# Altium schematic sheet 12_LPDDR4.schdoc
size 431 x 309 mm; Symbol: Sheet-Symbol_A4; Device: Sheet-Symbol_A4; Company: 嘉立创EDA; Version: V1.0; Page Size: A4; @Project Name: RK3568核心板; @Page Count: 11; @Update Date: 2024-10-10; @Create Date: 2024-10-10; @Schematic Name: Schematic1; @Page No: 11; @Page Name: LPDDR4; @Board Name: Board1; @Create Time: 11:38:53; @Update Time: 14:28:43; Width: 1655; Height: 1170; Region Start: 1; X Region Count: 6; Y Region Count: 4; Blade Width: 10; Title Block Position: 3
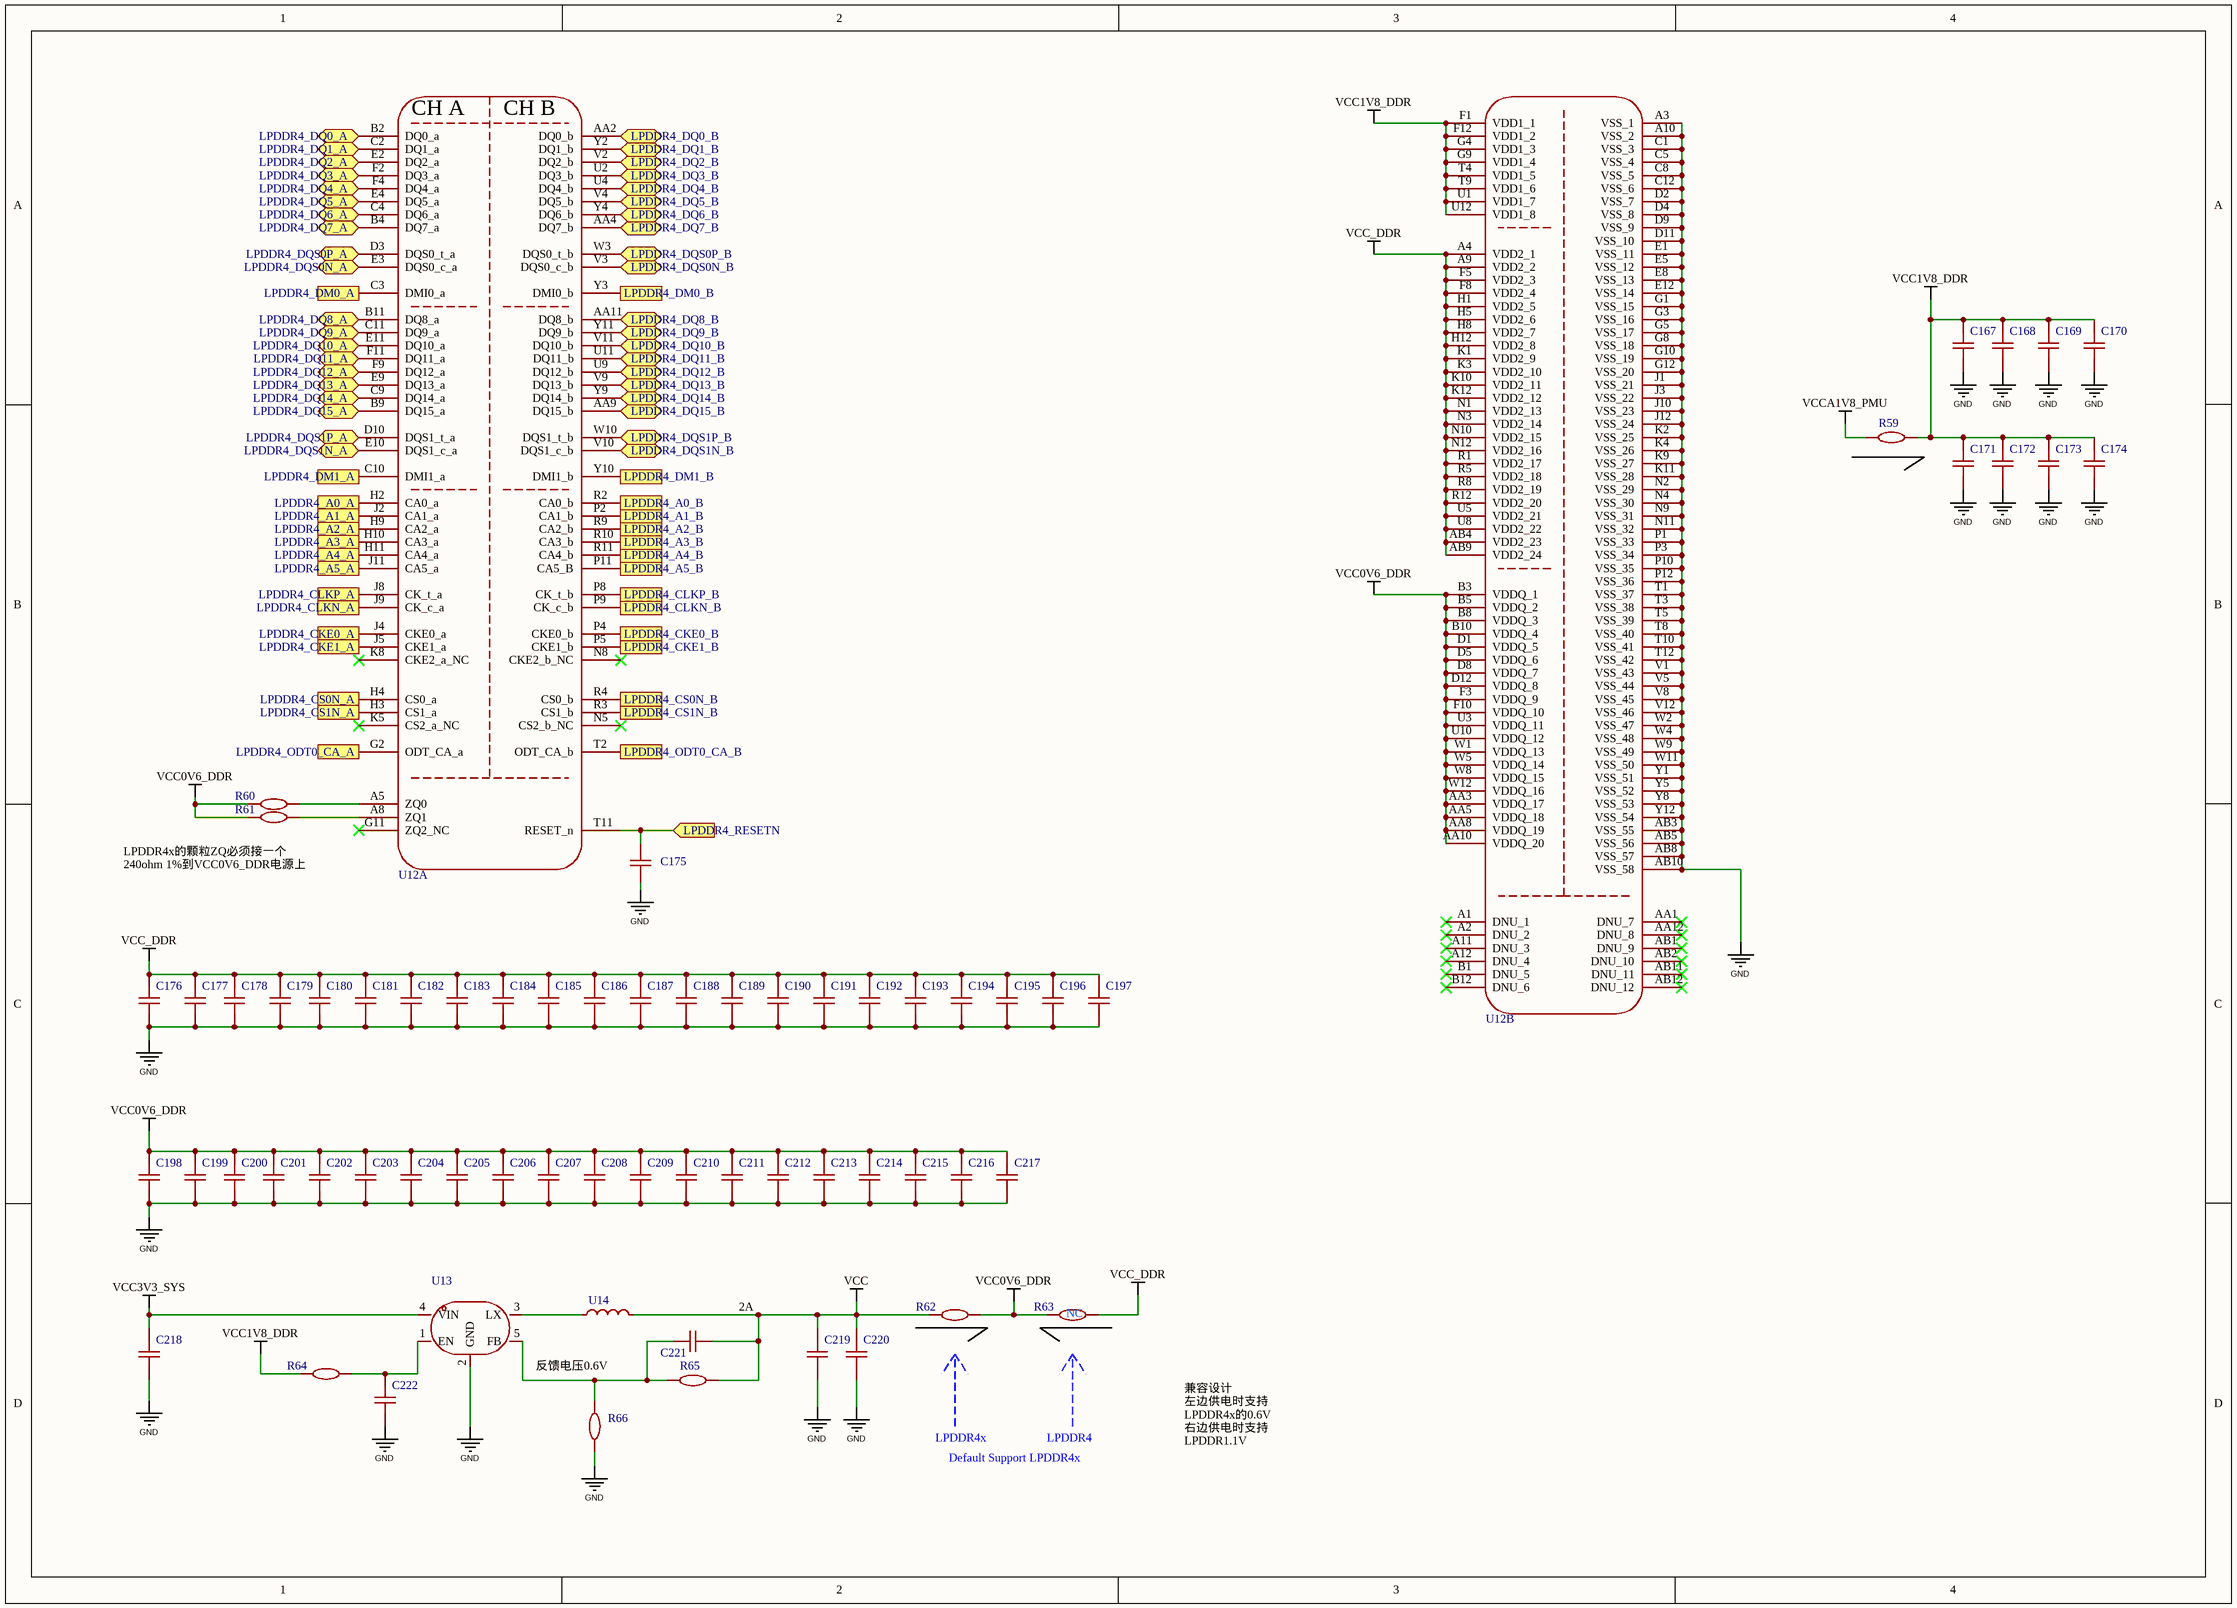
[diagram p0: 12_LPDDR4.schdoc]

## Parts
C167  10uF  [C0402]  (value not drawn)
C168  100nF  [C0402]  (value not drawn)
C169  100nF  [C0402]  (value not drawn)
C170  100nF  [C0402]  (value not drawn)
C171  10uF  [C0402]  (value not drawn)
C172  100nF  [C0402]  (value not drawn)
C173  100nF  [C0402]  (value not drawn)
C174  100nF  [C0402]  (value not drawn)
C175  1nF  [C0402]  (value not drawn)
C176  22uF  [C0603]  (value not drawn)
C177  10uF  [C0402]  (value not drawn)
C178  10uF  [C0402]  (value not drawn)
C179  1uF  [C0402]  (value not drawn)
C180  100nF  [C0402]  (value not drawn)
C181  100nF  [C0402]  (value not drawn)
C182  100nF  [C0402]  (value not drawn)
C183  100nF  [C0402]  (value not drawn)
C184  100nF  [C0402]  (value not drawn)
C185  100nF  [C0402]  (value not drawn)
C186  100nF  [C0402]  (value not drawn)
C187  100nF  [C0402]  (value not drawn)
C188  100nF  [C0402]  (value not drawn)
C189  100nF  [C0402]  (value not drawn)
C190  100nF  [C0402]  (value not drawn)
C191  100nF  [C0402]  (value not drawn)
C192  100nF  [C0402]  (value not drawn)
C193  100nF  [C0402]  (value not drawn)
C194  100nF  [C0402]  (value not drawn)
C195  100nF  [C0402]  (value not drawn)
C196  100nF  [C0402]  (value not drawn)
C197  100nF  [C0402]  (value not drawn)
C198  22uF  [C0603]  (value not drawn)
C199  10uF  [C0402]  (value not drawn)
C200  10uF  [C0402]  (value not drawn)
C201  1uF  [C0402]  (value not drawn)
C202  100nF  [C0402]  (value not drawn)
C203  100nF  [C0402]  (value not drawn)
C204  100nF  [C0402]  (value not drawn)
C205  100nF  [C0402]  (value not drawn)
C206  100nF  [C0402]  (value not drawn)
C207  100nF  [C0402]  (value not drawn)
C208  100nF  [C0402]  (value not drawn)
C209  100nF  [C0402]  (value not drawn)
C210  100nF  [C0402]  (value not drawn)
C211  100nF  [C0402]  (value not drawn)
C212  100nF  [C0402]  (value not drawn)
C213  100nF  [C0402]  (value not drawn)
C214  100nF  [C0402]  (value not drawn)
C215  100nF  [C0402]  (value not drawn)
C216  100nF  [C0402]  (value not drawn)
C217  100nF  [C0402]  (value not drawn)
C218  10uF  [C0402]  (value not drawn)
C219  22uF  [C0603]  (value not drawn)
C220  100nF  [C0402]  (value not drawn)
C221  22pF  [C0402]  (value not drawn)
C222  100nF  [C0402]  (value not drawn)
R59  0Ω  [R0603]  (value not drawn)
R60  240Ω  [R0402]  (value not drawn)
R61  240Ω  [R0402]  (value not drawn)
R62  0Ω  [R0603]  (value not drawn)
R63  0Ω  [R0603]  (value not drawn)
R64  100kΩ  [R0402]  (value not drawn)
R65  2kΩ  [R0402]  (value not drawn)
R66  100kΩ  [R0402]  (value not drawn)
U12  MT53D512M32D2DS  [BGA200_15R00X10R00X0R90]  (value not drawn)  (parts A,B of 2)
U13  RT8097CHGB  [SOT-23-5_L3.0-W1.7-P0.95-LS2.8-BR]  (value not drawn)
U14  2.2uH  [IND-SMD_L2.5-W2.0_FTC252010S]  (value not drawn)

## Ports
LPDDR4_A0_A (in), LPDDR4_A0_B (in), LPDDR4_A1_A (in), LPDDR4_A1_B (in), LPDDR4_A2_A (in), LPDDR4_A2_B (in), LPDDR4_A3_A (in), LPDDR4_A3_B (in), LPDDR4_A4_A (in), LPDDR4_A4_B (in), LPDDR4_A5_A (in), LPDDR4_A5_B (in), LPDDR4_CKE0_A (in), LPDDR4_CKE0_B (in), LPDDR4_CKE1_A (in), LPDDR4_CKE1_B (in), LPDDR4_CLKN_A (in), LPDDR4_CLKN_B (in), LPDDR4_CLKP_A (in), LPDDR4_CLKP_B (in), LPDDR4_CS0N_A (in), LPDDR4_CS0N_B (in), LPDDR4_CS1N_A (in), LPDDR4_CS1N_B (in), LPDDR4_DM0_A (out), LPDDR4_DM0_B (in), LPDDR4_DM1_A (out), LPDDR4_DM1_B (in), LPDDR4_DQ0_A (bidir), LPDDR4_DQ0_B (bidir), LPDDR4_DQ1_A (bidir), LPDDR4_DQ1_B (bidir), LPDDR4_DQ2_A (bidir), LPDDR4_DQ2_B (bidir), LPDDR4_DQ3_A (bidir), LPDDR4_DQ3_B (bidir), LPDDR4_DQ4_A (bidir), LPDDR4_DQ4_B (bidir), LPDDR4_DQ5_A (bidir), LPDDR4_DQ5_B (bidir), LPDDR4_DQ6_A (bidir), LPDDR4_DQ6_B (bidir), LPDDR4_DQ7_A (bidir), LPDDR4_DQ7_B (bidir), LPDDR4_DQ8_A (bidir), LPDDR4_DQ8_B (bidir), LPDDR4_DQ9_A (bidir), LPDDR4_DQ9_B (bidir), LPDDR4_DQ10_A (bidir), LPDDR4_DQ10_B (bidir), LPDDR4_DQ11_A (bidir), LPDDR4_DQ11_B (bidir), LPDDR4_DQ12_A (bidir), LPDDR4_DQ12_B (bidir), LPDDR4_DQ13_A (bidir), LPDDR4_DQ13_B (bidir), LPDDR4_DQ14_A (bidir), LPDDR4_DQ14_B (bidir), LPDDR4_DQ15_A (bidir), LPDDR4_DQ15_B (bidir), LPDDR4_DQS0N_A (bidir), LPDDR4_DQS0N_B (bidir), LPDDR4_DQS0P_A (bidir), LPDDR4_DQS0P_B (bidir), LPDDR4_DQS1N_A (bidir), LPDDR4_DQS1N_B (bidir), LPDDR4_DQS1P_A (bidir), LPDDR4_DQS1P_B (bidir), LPDDR4_ODT0_CA_A (in), LPDDR4_ODT0_CA_B (in), LPDDR4_RESETN (in)

## Nets
GND: C167.1 C168.1 C169.1 C170.1 C171.1 C172.1 C173.1 C174.1 C175.1 C176.1 C177.1 C178.1 C179.1 C180.1 C181.1 C182.1 C183.1 C184.1 C185.1 C186.1 C187.1 C188.1 C189.1 C190.1 C191.1 C192.1 C193.1 C194.1 C195.1 C196.1 C197.1 C198.1 C199.1 C200.1 C201.1 C202.1 C203.1 C204.1 C205.1 C206.1 C207.1 C208.1 C209.1 C210.1 C211.1 C212.1 C213.1 C214.1 C215.1 C216.1 C217.1 C218.1 C219.1 C220.1 C222.1 R66.1 U12.A3(VSS_1) U12.A10(VSS_2) U12.AB3(VSS_55) U12.AB5(VSS_56) U12.AB8(VSS_57) U12.AB10(VSS_58) U12.C1(VSS_3) U12.C5(VSS_4) U12.C8(VSS_5) U12.C12(VSS_6) U12.D2(VSS_7) U12.D4(VSS_8) U12.D9(VSS_9) U12.D11(VSS_10) U12.E1(VSS_11) U12.E5(VSS_12) U12.E8(VSS_13) U12.E12(VSS_14) U12.G1(VSS_15) U12.G3(VSS_16) U12.G5(VSS_17) U12.G8(VSS_18) U12.G10(VSS_19) U12.G12(VSS_20) U12.J1(VSS_21) U12.J3(VSS_22) U12.J10(VSS_23) U12.J12(VSS_24) U12.K2(VSS_25) U12.K4(VSS_26) U12.K9(VSS_27) U12.K11(VSS_28) U12.N2(VSS_29) U12.N4(VSS_30) U12.N9(VSS_31) U12.N11(VSS_32) U12.P1(VSS_33) U12.P3(VSS_34) U12.P10(VSS_35) U12.P12(VSS_36) U12.T1(VSS_37) U12.T3(VSS_38) U12.T5(VSS_39) U12.T8(VSS_40) U12.T10(VSS_41) U12.T12(VSS_42) U12.V1(VSS_43) U12.V5(VSS_44) U12.V8(VSS_45) U12.V12(VSS_46) U12.W2(VSS_47) U12.W4(VSS_48) U12.W9(VSS_49) U12.W11(VSS_50) U12.Y1(VSS_51) U12.Y5(VSS_52) U12.Y8(VSS_53) U12.Y12(VSS_54) U13.2(GND)
VCC: C219.2 C220.2 C221.2 R62.1 R65.2 U14.2
VCC0V6_DDR: C198.2 C199.2 C200.2 C201.2 C202.2 C203.2 C204.2 C205.2 C206.2 C207.2 C208.2 C209.2 C210.2 C211.2 C212.2 C213.2 C214.2 C215.2 C216.2 C217.2 R60.1 R61.1 R62.2 R63.1 U12.AA3(VDDQ_17) U12.AA5(VDDQ_18) U12.AA8(VDDQ_19) U12.AA10(VDDQ_20) U12.B3(VDDQ_1) U12.B5(VDDQ_2) U12.B8(VDDQ_3) U12.B10(VDDQ_4) U12.D1(VDDQ_5) U12.D5(VDDQ_6) U12.D8(VDDQ_7) U12.D12(VDDQ_8) U12.F3(VDDQ_9) U12.F10(VDDQ_10) U12.U3(VDDQ_11) U12.U10(VDDQ_12) U12.W1(VDDQ_13) U12.W5(VDDQ_14) U12.W8(VDDQ_15) U12.W12(VDDQ_16)
VCC1V8_DDR: C167.2 C168.2 C169.2 C170.2 C171.2 C172.2 C173.2 C174.2 R59.2 R64.1 U12.F1(VDD1_1) U12.F12(VDD1_2) U12.G4(VDD1_3) U12.G9(VDD1_4) U12.T4(VDD1_5) U12.T9(VDD1_6) U12.U1(VDD1_7) U12.U12(VDD1_8)
VCC3V3_SYS: C218.2 U13.4(VIN)
VCC_DDR: C176.2 C177.2 C178.2 C179.2 C180.2 C181.2 C182.2 C183.2 C184.2 C185.2 C186.2 C187.2 C188.2 C189.2 C190.2 C191.2 C192.2 C193.2 C194.2 C195.2 C196.2 C197.2 R63.2 U12.A4(VDD2_1) U12.A9(VDD2_2) U12.AB4(VDD2_23) U12.AB9(VDD2_24) U12.F5(VDD2_3) U12.F8(VDD2_4) U12.H1(VDD2_5) U12.H5(VDD2_6) U12.H8(VDD2_7) U12.H12(VDD2_8) U12.K1(VDD2_9) U12.K3(VDD2_10) U12.K10(VDD2_11) U12.K12(VDD2_12) U12.N1(VDD2_13) U12.N3(VDD2_14) U12.N10(VDD2_15) U12.N12(VDD2_16) U12.R1(VDD2_17) U12.R5(VDD2_18) U12.R8(VDD2_19) U12.R12(VDD2_20) U12.U5(VDD2_21) U12.U8(VDD2_22)
VCCA1V8_PMU: R59.1
LPDDR4_A0_A: U12.H2(CA0_a) ; port LPDDR4_A0_A
LPDDR4_A0_B: U12.R2(CA0_b) ; port LPDDR4_A0_B
LPDDR4_A1_A: U12.J2(CA1_a) ; port LPDDR4_A1_A
LPDDR4_A1_B: U12.P2(CA1_b) ; port LPDDR4_A1_B
LPDDR4_A2_A: U12.H9(CA2_a) ; port LPDDR4_A2_A
LPDDR4_A2_B: U12.R9(CA2_b) ; port LPDDR4_A2_B
LPDDR4_A3_A: U12.H10(CA3_a) ; port LPDDR4_A3_A
LPDDR4_A3_B: U12.R10(CA3_b) ; port LPDDR4_A3_B
LPDDR4_A4_A: U12.H11(CA4_a) ; port LPDDR4_A4_A
LPDDR4_A4_B: U12.R11(CA4_b) ; port LPDDR4_A4_B
LPDDR4_A5_A: U12.J11(CA5_a) ; port LPDDR4_A5_A
LPDDR4_A5_B: U12.P11(CA5_B) ; port LPDDR4_A5_B
LPDDR4_CKE0_A: U12.J4(CKE0_a) ; port LPDDR4_CKE0_A
LPDDR4_CKE0_B: U12.P4(CKE0_b) ; port LPDDR4_CKE0_B
LPDDR4_CKE1_A: U12.J5(CKE1_a) ; port LPDDR4_CKE1_A
LPDDR4_CKE1_B: U12.P5(CKE1_b) ; port LPDDR4_CKE1_B
LPDDR4_CLKN_A: U12.J9(CK_c_a) ; port LPDDR4_CLKN_A
LPDDR4_CLKN_B: U12.P9(CK_c_b) ; port LPDDR4_CLKN_B
LPDDR4_CLKP_A: U12.J8(CK_t_a) ; port LPDDR4_CLKP_A
LPDDR4_CLKP_B: U12.P8(CK_t_b) ; port LPDDR4_CLKP_B
LPDDR4_CS0N_A: U12.H4(CS0_a) ; port LPDDR4_CS0N_A
LPDDR4_CS0N_B: U12.R4(CS0_b) ; port LPDDR4_CS0N_B
LPDDR4_CS1N_A: U12.H3(CS1_a) ; port LPDDR4_CS1N_A
LPDDR4_CS1N_B: U12.R3(CS1_b) ; port LPDDR4_CS1N_B
LPDDR4_DM0_A: U12.C3(DMI0_a) ; port LPDDR4_DM0_A
LPDDR4_DM0_B: U12.Y3(DMI0_b) ; port LPDDR4_DM0_B
LPDDR4_DM1_A: U12.C10(DMI1_a) ; port LPDDR4_DM1_A
LPDDR4_DM1_B: U12.Y10(DMI1_b) ; port LPDDR4_DM1_B
LPDDR4_DQ0_A: U12.B2(DQ0_a) ; port LPDDR4_DQ0_A
LPDDR4_DQ0_B: U12.AA2(DQ0_b) ; port LPDDR4_DQ0_B
LPDDR4_DQ1_A: U12.C2(DQ1_a) ; port LPDDR4_DQ1_A
LPDDR4_DQ1_B: U12.Y2(DQ1_b) ; port LPDDR4_DQ1_B
LPDDR4_DQ2_A: U12.E2(DQ2_a) ; port LPDDR4_DQ2_A
LPDDR4_DQ2_B: U12.V2(DQ2_b) ; port LPDDR4_DQ2_B
LPDDR4_DQ3_A: U12.F2(DQ3_a) ; port LPDDR4_DQ3_A
LPDDR4_DQ3_B: U12.U2(DQ3_b) ; port LPDDR4_DQ3_B
LPDDR4_DQ4_A: U12.F4(DQ4_a) ; port LPDDR4_DQ4_A
LPDDR4_DQ4_B: U12.U4(DQ4_b) ; port LPDDR4_DQ4_B
LPDDR4_DQ5_A: U12.E4(DQ5_a) ; port LPDDR4_DQ5_A
LPDDR4_DQ5_B: U12.V4(DQ5_b) ; port LPDDR4_DQ5_B
LPDDR4_DQ6_A: U12.C4(DQ6_a) ; port LPDDR4_DQ6_A
LPDDR4_DQ6_B: U12.Y4(DQ6_b) ; port LPDDR4_DQ6_B
LPDDR4_DQ7_A: U12.B4(DQ7_a) ; port LPDDR4_DQ7_A
LPDDR4_DQ7_B: U12.AA4(DQ7_b) ; port LPDDR4_DQ7_B
LPDDR4_DQ8_A: U12.B11(DQ8_a) ; port LPDDR4_DQ8_A
LPDDR4_DQ8_B: U12.AA11(DQ8_b) ; port LPDDR4_DQ8_B
LPDDR4_DQ9_A: U12.C11(DQ9_a) ; port LPDDR4_DQ9_A
LPDDR4_DQ9_B: U12.Y11(DQ9_b) ; port LPDDR4_DQ9_B
LPDDR4_DQ10_A: U12.E11(DQ10_a) ; port LPDDR4_DQ10_A
LPDDR4_DQ10_B: U12.V11(DQ10_b) ; port LPDDR4_DQ10_B
LPDDR4_DQ11_A: U12.F11(DQ11_a) ; port LPDDR4_DQ11_A
LPDDR4_DQ11_B: U12.U11(DQ11_b) ; port LPDDR4_DQ11_B
LPDDR4_DQ12_A: U12.F9(DQ12_a) ; port LPDDR4_DQ12_A
LPDDR4_DQ12_B: U12.U9(DQ12_b) ; port LPDDR4_DQ12_B
LPDDR4_DQ13_A: U12.E9(DQ13_a) ; port LPDDR4_DQ13_A
LPDDR4_DQ13_B: U12.V9(DQ13_b) ; port LPDDR4_DQ13_B
LPDDR4_DQ14_A: U12.C9(DQ14_a) ; port LPDDR4_DQ14_A
LPDDR4_DQ14_B: U12.Y9(DQ14_b) ; port LPDDR4_DQ14_B
LPDDR4_DQ15_A: U12.B9(DQ15_a) ; port LPDDR4_DQ15_A
LPDDR4_DQ15_B: U12.AA9(DQ15_b) ; port LPDDR4_DQ15_B
LPDDR4_DQS0N_A: U12.E3(DQS0_c_a) ; port LPDDR4_DQS0N_A
LPDDR4_DQS0N_B: U12.V3(DQS0_c_b) ; port LPDDR4_DQS0N_B
LPDDR4_DQS0P_A: U12.D3(DQS0_t_a) ; port LPDDR4_DQS0P_A
LPDDR4_DQS0P_B: U12.W3(DQS0_t_b) ; port LPDDR4_DQS0P_B
LPDDR4_DQS1N_A: U12.E10(DQS1_c_a) ; port LPDDR4_DQS1N_A
LPDDR4_DQS1N_B: U12.V10(DQS1_c_b) ; port LPDDR4_DQS1N_B
LPDDR4_DQS1P_A: U12.D10(DQS1_t_a) ; port LPDDR4_DQS1P_A
LPDDR4_DQS1P_B: U12.W10(DQS1_t_b) ; port LPDDR4_DQS1P_B
LPDDR4_ODT0_CA_A: U12.G2(ODT_CA_a) ; port LPDDR4_ODT0_CA_A
LPDDR4_ODT0_CA_B: U12.T2(ODT_CA_b) ; port LPDDR4_ODT0_CA_B
LPDDR4_RESETN: C175.2 U12.T11(RESET_n) ; port LPDDR4_RESETN
NetC221_1: C221.1 R65.1 R66.2 U13.5(FB)
NetC222_2: C222.2 R64.2 U13.1(EN)
NetR60_2: R60.2 U12.A5(ZQ0)
NetR61_2: R61.2 U12.A8(ZQ1)
NetU13_3: U13.3(LX) U14.1

Not connected (* = marked no-connect by the designer): U12 A1(DNU_1)* A2(DNU_2)* A11(DNU_3)* A12(DNU_4)* AA1(DNU_7)* AA12(DNU_8)* AB1(DNU_9)* AB2(DNU_10)* AB11(DNU_11)* AB12(DNU_12)* B1(DNU_5)* B12(DNU_6)* G11(ZQ2_NC)* K5(CS2_a_NC)* K8(CKE2_a_NC)* N5(CS2_b_NC)* N8(CKE2_b_NC)*

## Notes on the sheet
- LPDDR4x的颗粒ZQ必须接一个240ohm 1%到VCC0V6_DDR电源上
- 反馈电压0.6V
- 2A
- (near R63) NC
- LPDDR4x
- Default Support LPDDR4x
- LPDDR4
- 兼容设计
  左边供电时支持LPDDR4x的0.6V
  右边供电时支持LPDDR1.1V
- 1
- 2
- 3
- 4
- 5
- 6
- A
- B
- C
- D
- 原理图
- Schematic1
- 创建日期
- 更新日期
- 2024-10-10
- 审阅
- 绘制
- 图页
- 物料编码
- RK3568核心板
- 版本
- 尺寸
- 页
- 11
- 共
- V1.0
- A4
- 嘉立创EDA
- (in symbol MT53D512M32D2DS, part A) CH A; CH B

## Library data of the parts
C167 C171 C177 C178 C199 C200 C218 = CL05A106MP5NUNC: 容值:10uF;精度:±20%;额定电压:10V;材质(温度系数):X5R;; Manufacturer: SAMSUNG(三星); Symbol: CL05A106MP5NUNC_C315248; Add into BOM: yes; Tolerance: ±20%; Voltage Rated: 10V; Temperature Coefficient: X5R; Device: CL05A106MP5NUNC; LCSC Part Name: 10uF ±20% 10V; Supplier Part: C315248; Manufacturer Part: CL05A106MP5NUNC; Supplier Footprint: 0402; JLCPCB Part Class: 扩展库; Datasheet: https://atta.szlcsc.com/upload/public/pdf/source/20231220/1EF805BAE1520675928CC4638D279E74.pdf; Supplier: LCSC; Convert to PCB: yes; Value: 10uF
C168-C170 C172-C174 C180-C197 C202-C217 C220 C222 = CL05B104KB54PNC: 容值:100nF;精度:±10%;额定电压:50V;材质(温度系数):X7R;; Manufacturer: SAMSUNG(三星); Add into BOM: yes; Tolerance: ±10%; Voltage Rated: 50V; Temperature Coefficient: X7R; Symbol: CL05B104KB54PNC; Device: CL05B104KB54PNC; LCSC Part Name: 100nF ±10% 50V; Supplier Part: C307331; Manufacturer Part: CL05B104KB54PNC; Supplier Footprint: 0402; JLCPCB Part Class: 基础库; Datasheet: https://atta.szlcsc.com/upload/public/pdf/source/20160218/1457707763339.pdf; Supplier: LCSC; Convert to PCB: yes; Value: 100nF
C175 = CC0402KRX7R9BB102: 容值:1nF;精度:±10%;额定电压:50V;材质(温度系数):X7R;; Manufacturer: YAGEO(国巨); Add into BOM: yes; Tolerance: ±10%; Voltage Rated: 50V; Temperature Coefficient: X7R; Symbol: CC0402KRX7R9BB102; Device: CC0402KRX7R9BB102; Supplier: LCSC; Manufacturer Part: CC0402KRX7R9BB102; Value: 1nF; Supplier Part: C106205; JLCPCB Part Class: 扩展库; LCSC Part Name: 1nF ±10% 50V; Supplier Footprint: 0402; Datasheet: https://atta.szlcsc.com/upload/public/pdf/source/20181008/C309510_22F155564471FAF6A489F7D68F34234E.pdf; Convert to PCB: yes
C176 C198 C219 = CL10A226MQ8NRNC: 容值:22uF;精度:±20%;额定电压:6.3V;材质(温度系数):X5R;; Manufacturer: SAMSUNG(三星); Add into BOM: yes; Tolerance: ±20%; Voltage Rated: 6.3V; Temperature Coefficient: X5R; Symbol: CL10A226MQ8NRNC; Device: CL10A226MQ8NRNC; LCSC Part Name: 22uF ±20% 6.3V; Supplier Part: C59461; Manufacturer Part: CL10A226MQ8NRNC; Supplier Footprint: 0603; JLCPCB Part Class: 基础库; Datasheet: https://atta.szlcsc.com/upload/public/pdf/source/20160218/1457707763339.pdf; Supplier: LCSC; Convert to PCB: yes; Value: 22uF
C179 C201 = CL05A105KA5NQNC: 容值:1uF;精度:±10%;额定电压:25V;材质(温度系数):X5R;; Manufacturer: SAMSUNG(三星); Add into BOM: yes; Tolerance: ±10%; Voltage Rated: 25V; Temperature Coefficient: X5R; Symbol: CL05A105KA5NQNC; Device: CL05A105KA5NQNC; LCSC Part Name: 1uF ±10% 25V; Supplier Part: C52923; Manufacturer Part: CL05A105KA5NQNC; Supplier Footprint: 0402; JLCPCB Part Class: 基础库; Datasheet: https://atta.szlcsc.com/upload/public/pdf/source/20160218/1457707763339.pdf; Supplier: LCSC; Convert to PCB: yes; Value: 1uF
C221 = 0402CG220J500NT: 容值:22pF;精度:±5%;额定电压:50V;材质(温度系数):C0G;; Manufacturer: FH(风华); Add into BOM: yes; Tolerance: ±5%; Voltage Rated: 50V; Temperature Coefficient: C0G; Symbol: 0402CG220J500NT; Device: 0402CG220J500NT; LCSC Part Name: 22pF ±5% 50V; Supplier Part: C1555; Manufacturer Part: 0402CG220J500NT; Supplier Footprint: 0402; JLCPCB Part Class: 基础库; Datasheet: https://atta.szlcsc.com/upload/public/pdf/source/20200305/C486355_26A10D38EF8C2A5C37091D0039909270.pdf; Supplier: LCSC; Convert to PCB: yes; Value: 22pF
R59 R62 R63 = 0603WAF0000T5E: 电阻类型:厚膜电阻;阻值:0Ω;精度:±1%;功率:100mW;最大工作电压:75V;; Manufacturer: UNI-ROYAL(厚声); Add into BOM: yes; Tolerance: ±1%; Power(Watts): 100mW; Overload Voltage (Max): 75V; Symbol: 0603WAF0000T5E; Device: 0603WAF0000T5E; LCSC Part Name: 0Ω ±1% 100mW 厚膜电阻; Supplier Part: C21189; Manufacturer Part: 0603WAF0000T5E; Supplier Footprint: 0603; JLCPCB Part Class: 基础库; Datasheet: https://atta.szlcsc.com/upload/public/pdf/source/20200306/C422600_1E6D84923E4A46A82E41ADD87F860B5C.pdf; Supplier: LCSC; Convert to PCB: yes; Type: 厚膜电阻; Value: 0Ω; Operating Temperature Range: -55℃~+155℃
R60 R61 = 0402WGF2400TCE: 电阻类型:厚膜电阻;阻值:240Ω;精度:±1%;功率:62.5mW;最大工作电压:50V;温度系数:±100ppm/℃;; Manufacturer: UNI-ROYAL(厚声); Add into BOM: yes; Tolerance: ±1%; Power(Watts): 62.5mW; Overload Voltage (Max): 50V; Symbol: 0402WGF2400TCE; Device: 0402WGF2400TCE; Supplier: LCSC; Manufacturer Part: 0402WGF2400TCE; Supplier Part: C25094; Value: 240Ω; JLCPCB Part Class: 扩展库; LCSC Part Name: 240Ω ±1% 62.5mW 厚膜电阻; Supplier Footprint: 0402; Datasheet: https://atta.szlcsc.com/upload/public/pdf/source/20200306/C422600_1E6D84923E4A46A82E41ADD87F860B5C.pdf; Convert to PCB: yes; Type: 厚膜电阻; Temperature Coefficient: ±100ppm/℃; Operating Temperature Range: -55℃~+155℃
R64 R66 = 0402WGF1003TCE: 电阻类型:厚膜电阻;阻值:100kΩ;精度:±1%;功率:62.5mW;最大工作电压:50V;温度系数:±100ppm/℃;; Manufacturer: UNI-ROYAL(厚声); Add into BOM: yes; Tolerance: ±1%; Power(Watts): 62.5mW; Overload Voltage (Max): 50V; Symbol: 0402WGF1003TCE; Device: 0402WGF1003TCE; Supplier: LCSC; Manufacturer Part: 0402WGF1003TCE; Supplier Part: C25741; Value: 100kΩ; JLCPCB Part Class: 基础库; LCSC Part Name: 100kΩ ±1% 62.5mW 厚膜电阻; Supplier Footprint: 0402; Datasheet: https://atta.szlcsc.com/upload/public/pdf/source/20200306/C422600_1E6D84923E4A46A82E41ADD87F860B5C.pdf; Convert to PCB: yes; Type: 厚膜电阻; Temperature Coefficient: ±100ppm/℃; Operating Temperature Range: -55℃~+155℃
R65 = 0402WGF2001TCE: 电阻类型:厚膜电阻;阻值:2kΩ;精度:±1%;功率:62.5mW;最大工作电压:50V;温度系数:±100ppm/℃;; Manufacturer: UNI-ROYAL(厚声); Add into BOM: yes; Tolerance: ±1%; Power(Watts): 62.5mW; Overload Voltage (Max): 50V; Symbol: 0402WGF2001TCE; Device: 0402WGF2001TCE; Supplier: LCSC; Manufacturer Part: 0402WGF2001TCE; Supplier Part: C4109; Value: 2kΩ; JLCPCB Part Class: 基础库; LCSC Part Name: 2kΩ ±1% 62.5mW 厚膜电阻; Supplier Footprint: 0402; Datasheet: https://atta.szlcsc.com/upload/public/pdf/source/20200306/C422600_1E6D84923E4A46A82E41ADD87F860B5C.pdf; Convert to PCB: yes; Type: 厚膜电阻; Temperature Coefficient: ±100ppm/℃; Operating Temperature Range: -55℃~+155℃
U12 = MT53D512M32D2DS: Symbol: LPDDR4_200P; 规格: DDR4 SDRAM 大小：16Gb(512Mx32); 规格编号: MT53D512M32D2DS-053WT:D; 条码: EBF2950034; 品牌: 镁光; 类别: 存储器-DRAM; 规格书: Micron-Tech-MT53D512M32D2DS-053-WT-D.pdf; 生命周期: 量产; Add into BOM: yes; Relevance: []; Device: MT53D512M32D2DS; PCB Footprint: bga200_15r00x10r00x0r90; Convert to PCB: yes
U13 = RT8097CHGB: 功能类型:降压型;输出类型:可调;输入电压:2.7V~5.5V;输出电压:600mV~3.4V;输出电流(最大值):2A;; Manufacturer: RICHTEK(立锜); Add into BOM: yes; Function: 降压型; Output Type: 可调; Output Current (Max): 2A; Switching Frequency: 1MHz; Synchronous Rectification: 是; Number of Outputs: 1; Topology: 降压式; Switch tube (built-in/external): 内置; Symbol: RT8097CHGB; Device: RT8097CHGB; LCSC Part Name: RT8097CHGB; Supplier Part: C425768; Manufacturer Part: RT8097CHGB; Supplier Footprint: SOT-23-5; JLCPCB Part Class: 扩展库; Datasheet: https://atta.szlcsc.com/upload/public/pdf/source/20190911/C425768_2E4DD064882D9AD306DC34D36A47EEBF.pdf; Supplier: LCSC; Convert to PCB: yes; Input Voltage: 2.7V~5.5V; Output Voltage: 600mV~3.4V; Operating Temperature: -40℃~+85℃@(TA)
U14 = FTC252010S2R2MBCA: 电感值:2.2uH;精度:±20%;额定电流:2.4A;饱和电流(Isat):3.3A;类型:一体成型电感;; Manufacturer: cjiang(长江微电); Add into BOM: yes; Tolerance: ±20%; Rated Current: 2.4A; Saturation Current (Isat): 3.3A; DC Resistance (DCR): 62mΩ; Symbol: FTC252010S2R2MBCA; Device: FTC252010S2R2MBCA; LCSC Part Name: 2.2uH ±20% 3.3A; Supplier Part: C5832358; Manufacturer Part: FTC252010S2R2MBCA; Supplier Footprint: SMD,2x2.5mm; JLCPCB Part Class: 扩展库; Datasheet: https://atta.szlcsc.com/upload/public/pdf/source/20230602/8FFEDA9C0247A92A0D4B67554BFE4091.pdf; Supplier: LCSC; Convert to PCB: yes; Value: 2.2uH; Type: 一体成型电感